# Altium schematic sheet subtractor_single.SchDoc
size A
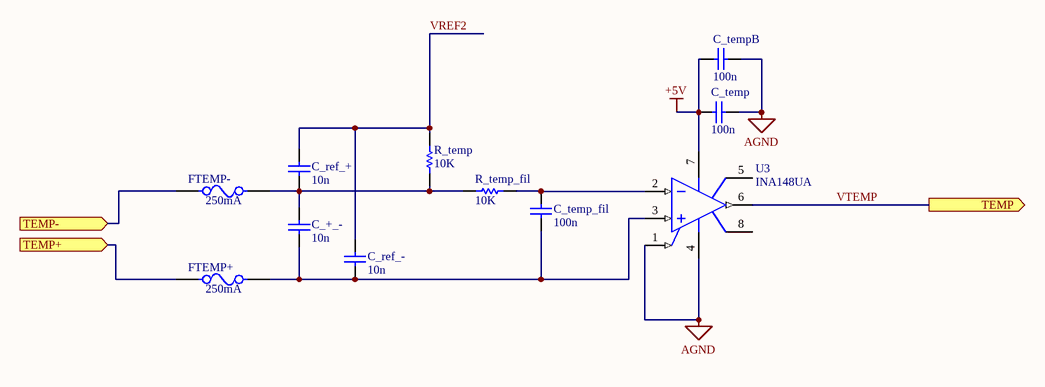
[diagram p0: subtractor_single.SchDoc]

## Parts
C_+_-  10n  [CAPC0603(1608)55_N]
C_ref_+  10n  [CAPC0603(1608)55_N]
C_ref_-  10n  [CAPC0603(1608)55_N]
C_temp  100n  [CAPC0603(1608)55_N]
C_temp_fil  100n  [CAPC0603(1608)55_N]
C_tempB  100n  [CAPC0603(1608)55_N]
FTEMP+  250mA  [RESC0603(1608)_N]
FTEMP-  250mA  [RESC0603(1608)_N]
R_temp  10K  [RESC0603(1608)_N]
R_temp_fil  10K  [RESC0603(1608)_N]
U3  INA148UA  [D0008A_N]

## Ports
TEMP (out), TEMP+ (in), TEMP- (in)

## Nets
+5V: C_temp.1 C_tempB.1 U3.7(V+)
AGND: C_temp.2 C_tempB.2 U3.1(REF) U3.4(V-)
TEMP+: FTEMP+.1 ; port TEMP+
TEMP-: FTEMP-.1 ; port TEMP-
VREF2: C_ref_+.2 C_ref_-.2 R_temp.2
VTEMP: U3.6(OUT) ; port TEMP
NetC_+_-_1: C_+_-.1 C_ref_-.1 C_temp_fil.1 FTEMP+.2 U3.3(IN+)
NetC_+_-_2: C_+_-.2 C_ref_+.1 FTEMP-.2 R_temp.1 R_temp_fil.2
NetC_temp_fil_2: C_temp_fil.2 R_temp_fil.1 U3.2(IN-)

Not connected (* = marked no-connect by the designer): U3 5(NC) 8(NC)

## Library data of the parts
C_+_- C_ref_+ C_ref_- = Cap 10n: Keramikvielschichtkondensator, SMD, Baureihe MC, ± 10%; Manufacturer: TDK; Voltage Rating: 50V; OC_MOUSER: CGA3E2X7R1H103K080AA; Value: 10n; PackageReference: 0603; Tolerance: ± 10%
C_temp C_temp_fil C_tempB = Cap 100n: Keramikvielschichtkondensator, SMD, Baureihe MC, ± 10%; Manufacturer: TDK; Voltage Rating: 50V; OC_MOUSER: CGA3E2X7R1H104K080AA; Value: 100n; PackageReference: 0603; Tolerance: ± 10%
FTEMP+ FTEMP- = Bel Fuse C2Q250: Fuse, Fast Blow 250mA, 63VDC; Voltage Rating AC: 32V; Voltage Rating DC: 63; OC_Mouser: 530-C2Q250; Value: 250mA; PackageReference: 0603; Manufacturer: Bel Fuse; Characteristic: Fast Blow
R_temp R_temp_fil = Res 10K: Chipwiderstand, SMD, Baureihe MC, 1%; Manufacturer: Multicomp; Power: 100mW; PackageReference: 0603; Value: 10K; OC_FARNELL: 9330399
U3 = CMP-0985-00055-2: +/- 200 V Common-Mode Voltage Difference Amplifier, -40 to 85 degC, 8-pin SOIC (D8), Green (RoHS & no Sb/Br); Manufacturer: Texas Instruments; Vs(Min)(V): 2.7; Slew Rate(Typ)(V/us): 1; CMRR(Min)(dB): 70; Input Offset (+/-)(Max)(uV): 5000; Vs(Max)(V): 36; DatasheetVersion: SBOS123; ComponentLink3Description: Package Specification; Gain(V/V): 1; PackageReference: D0008A; SubFamily: Difference Amplifier; PackageVersion: 4040047-3/M, 06/2011; Mounting Technology: Surface Mount; ComponentLink1Description: Manufacturer URL; Eco-Plan: Green (RoHS & no Sb/Br); Number of Channels: 1; ComponentLink1URL: http://www.ti.com/; ComponentLink2URL: http://www.ti.com/general/docs/lit/getliterature.tsp?genericPartNumber=INA148&fileType=pdf; PartNumber: INA148UA; ComponentLink3URL: http://www.ti.com/litv/pdf/msoi002j; ComponentLink2Description: Datasheet; PackageDescription: 8-Pin Plastic Small Outline, Body 4.9 x 3.9 mm, Pitch 1.27 mm; Code_JEDEC: MS-012